# Altium schematic sheet DiPAD плата управления-2.SchDoc
size 594 x 420 mm; SheetNumber: 2; PageSetup: Record=PageOptions|CenterHorizontal=False|CenterVertical=False|PrintScale=1.00|XCorrection=0.00|YCorrection=0.00|PrintKind=2|BorderSize=5000000|LeftOffset=0|BottomOffset=0|Orientation=2|PaperLength=1000|PaperWidth=1000|Scale=100|PaperSource=7|PrintQuality=600|MediaType=1|DitherType=10|PaperKind=A2|PrintScaleMode=0; DecimalNumber: ИТЦЯ.468332.393 Э3; HeadOfSector: Нач. сектора; MainDevice: Перв.примен.; Name1: Наименование; Name2: продолжение наименования; Scale: 1:1; SoglasGrafa: Соглас.; TcontrGrafa: Т.контр.; Title2: {Title2}; Title3: {Title3}; Document_type: {Type}; InvNo: {InvNo}; Document_type2: {Type2}
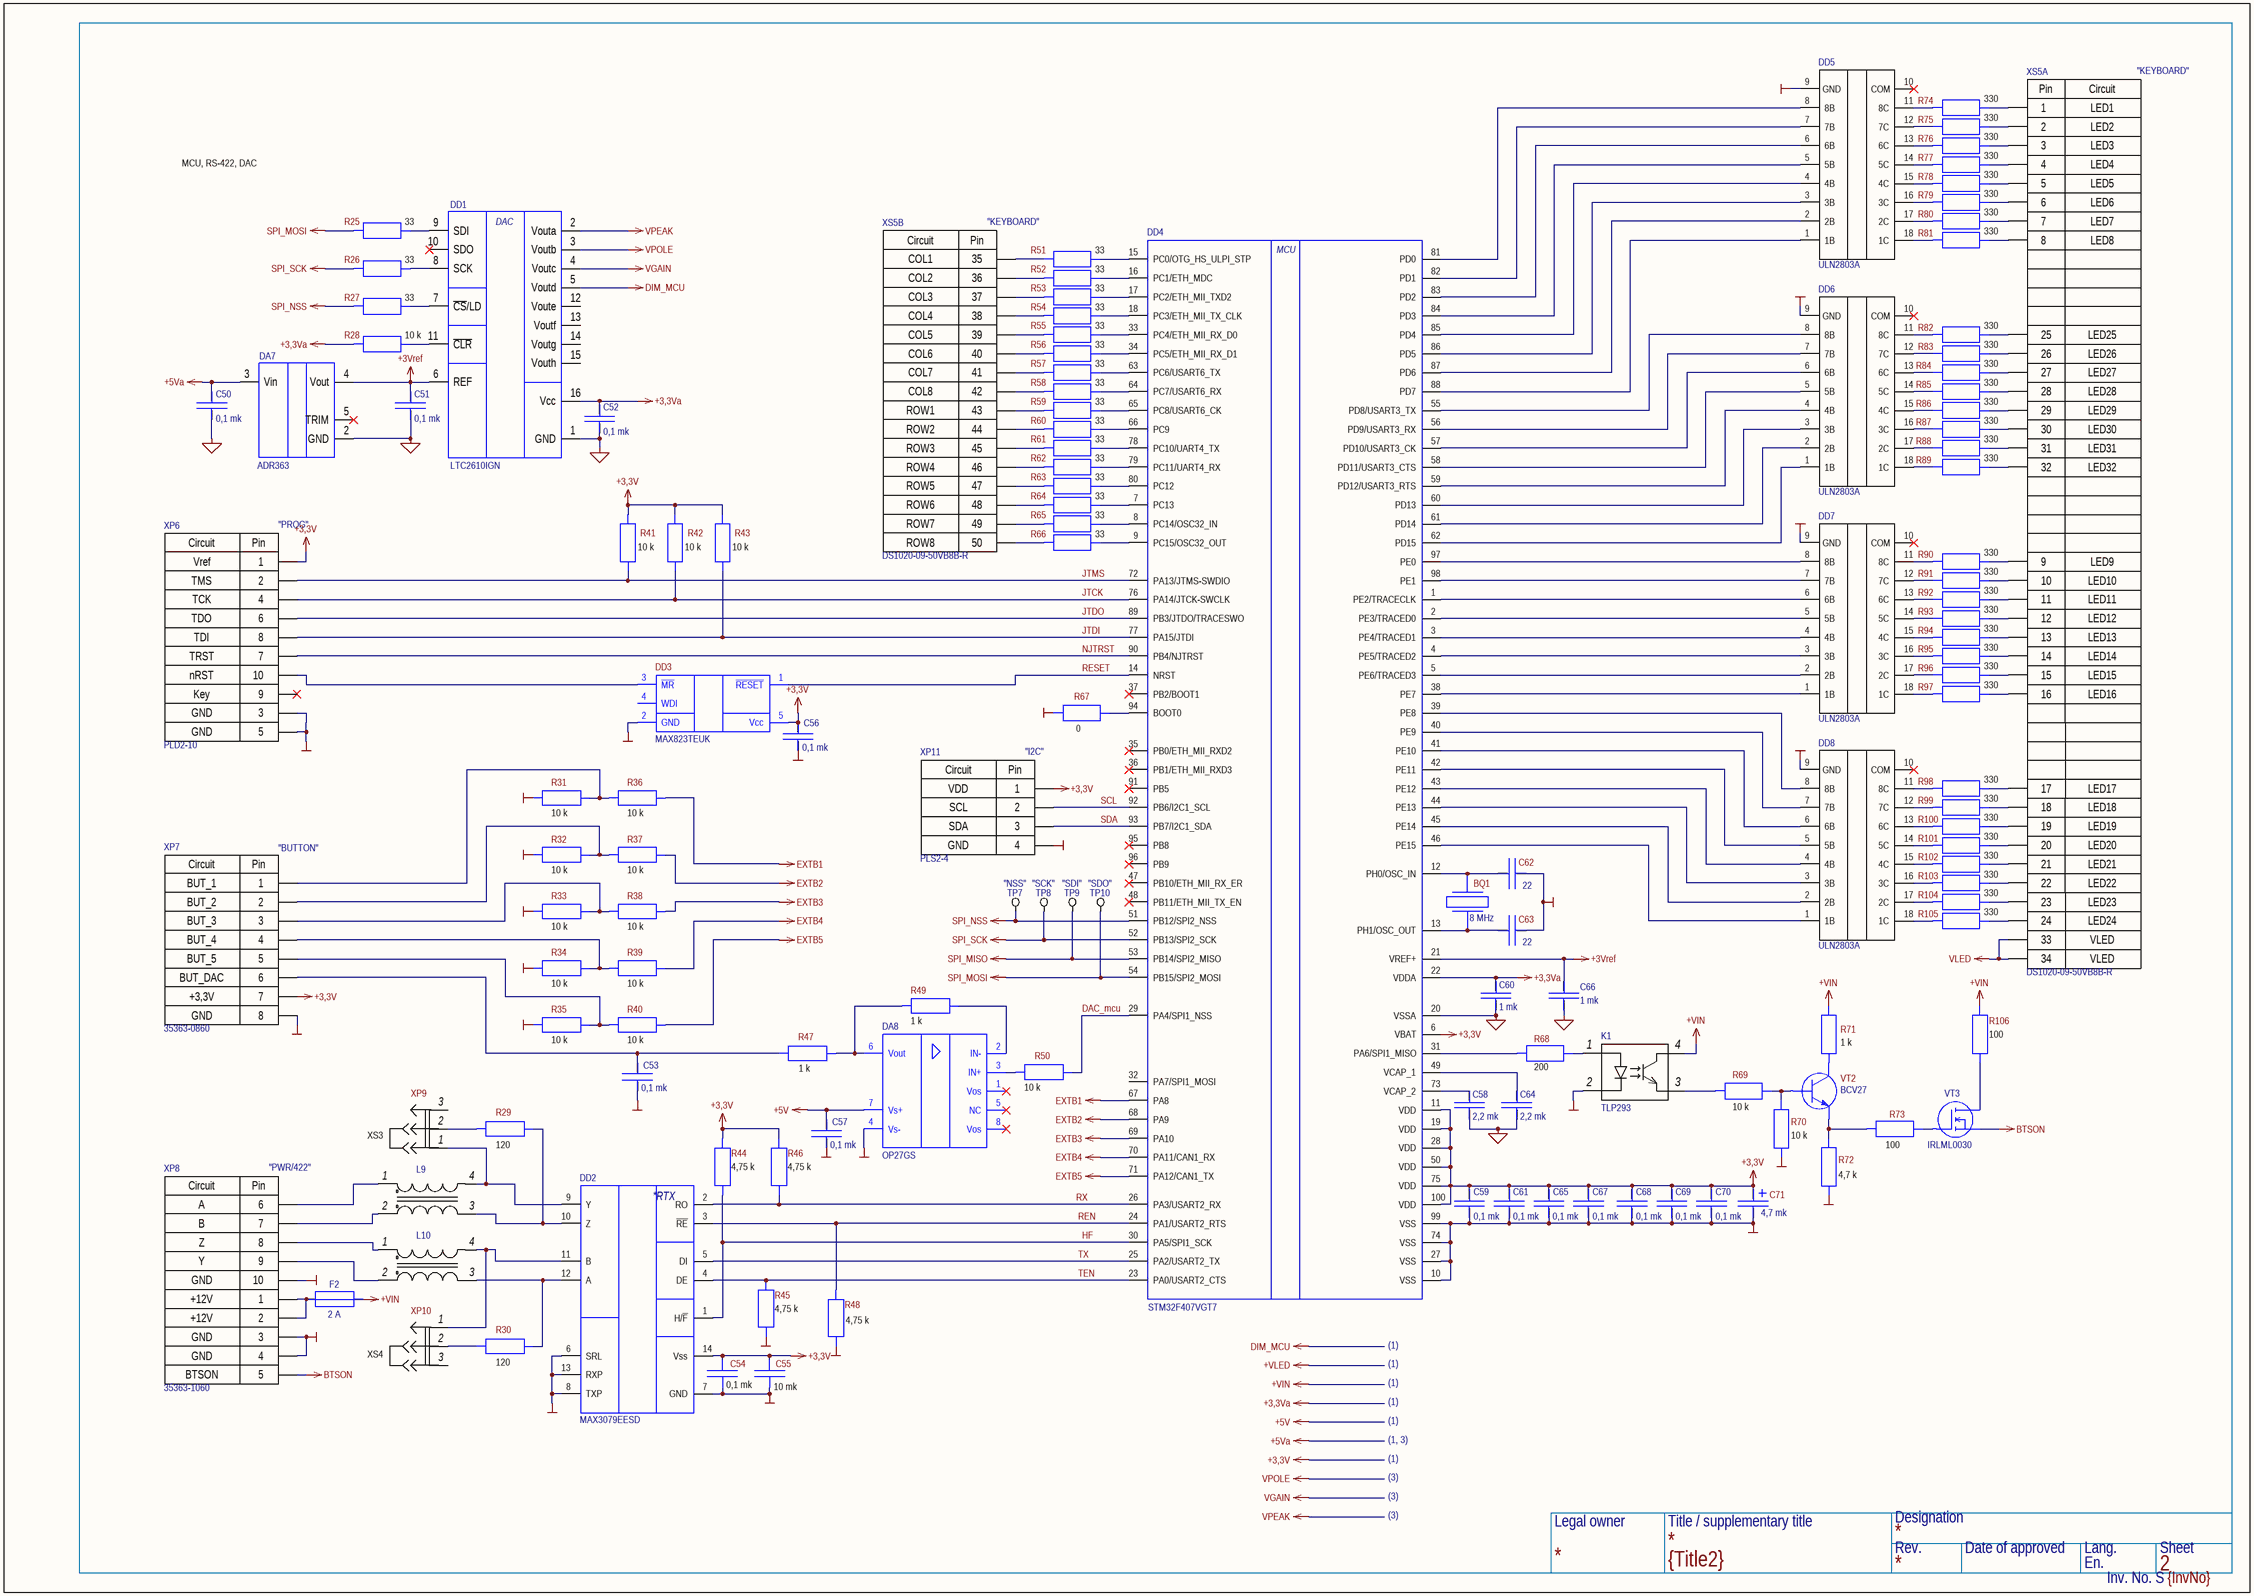
[diagram p0: DiPAD плата управления-2.SchDoc]

## Parts
BQ1  8 MHz  [CX5Z]
C50  value 0,1 mk  [C0603P(025)]  (hidden comment: C1206)
C51  value 0,1 mk  [C0603P(025)]  (hidden comment: C1206)
C52  value 0,1 mk  [C0603P(025)]  (hidden comment: C1206)
C53  value 0,1 mk  [C0603P(025)]  (hidden comment: C1206)
C54  0,1 mk  [C0603P(025)]
C55  10 mk  [C0603P(025)]
C56  value 0,1 mk  [C0603P(025)]  (hidden comment: C1206)
C57  value 0,1 mk  [C0603P(025)]  (hidden comment: C1206)
C58  value 2,2 mk  [C0603P(025)]  (hidden comment: C1206)
C59  value 0,1 mk  [C0603P(025)]  (hidden comment: C1206)
C60  value 1 mk  [C0603P(025)]  (hidden comment: C1206)
C61  value 0,1 mk  [C0603P(025)]  (hidden comment: C1206)
C62  value 22  [C0603P(025)]  (hidden comment: C0603)
C63  value 22  [C0603P(025)]  (hidden comment: C0603)
C64  value 2,2 mk  [C0603P(025)]  (hidden comment: C1206)
C65  value 0,1 mk  [C0603P(025)]  (hidden comment: C1206)
C66  value 1 mk  [C0603P(025)]  (hidden comment: C1206)
C67  value 0,1 mk  [C0603P(025)]  (hidden comment: C1206)
C68  value 0,1 mk  [C0603P(025)]  (hidden comment: C1206)
C69  value 0,1 mk  [C0603P(025)]  (hidden comment: C1206)
C70  value 0,1 mk  [C0603P(025)]  (hidden comment: C1206)
C71  value 4,7 mk  [TAJ-AP]  (hidden comment: TAJ_SMD_D)
DA7  ADR363  [ADR363]
DA8  OP27GS  [so-8P]
DD1  LTC2610IGN  [LTC2610IGN (SSOP-16)]
DD2  MAX3079EESD  [MAX3079 (SO-14)]
DD3  value MAX823TEUK  [MAX823-5]  (hidden comment: MAX823TEUKT)
DD4  STM32F407VGT7  [LQFP100]
DD5  ULN2803A  [ULN2803A (SOIC-18W)]
DD6  ULN2803A  [ULN2803A (SOIC-18W)]
DD7  ULN2803A  [ULN2803A (SOIC-18W)]
DD8  ULN2803A  [ULN2803A (SOIC-18W)]
F2  2 A  [fuse_0466 (1206)]
K1  TLP293  [TLP293(BL-TPL,E SO-4 TOSHIBA]
L9  744242471  [744242471 (WE-SLM)]  (value not drawn)
L10  744242471  [744242471 (WE-SLM)]  (value not drawn)
R25  33  [R0603P(025)]
R26  33  [R0603P(025)]
R27  33  [R0603P(025)]
R28  10 k  [R0603P(025)]
R29  120  [R1206PN]
R30  120  [R1206PN]
R31  10 k  [R0603P(025)]
R32  10 k  [R0603P(025)]
R33  10 k  [R0603P(025)]
R34  10 k  [R0603P(025)]
R35  10 k  [R0603P(025)]
R36  10 k  [R0603P(025)]
R37  10 k  [R0603P(025)]
R38  10 k  [R0603P(025)]
R39  10 k  [R0603P(025)]
R40  10 k  [R0603P(025)]
R41  10 k  [R0603P(025)]
R42  10 k  [R0603P(025)]
R43  10 k  [R0603P(025)]
R44  4,75 k  [R0603P(025)]
R45  4,75 k  [R0603P(025)]
R46  4,75 k  [R0603P(025)]
R47  1 k  [R0603P(025)]
R48  4,75 k  [R0603P(025)]
R49  1 k  [R0603P(025)]
R50  10 k  [R0603P(025)]
R51  33  [R0402P(025)]
R52  33  [R0402P(025)]
R53  33  [R0402P(025)]
R54  33  [R0402P(025)]
R55  33  [R0402P(025)]
R56  33  [R0402P(025)]
R57  33  [R0402P(025)]
R58  33  [R0402P(025)]
R59  33  [R0402P(025)]
R60  33  [R0402P(025)]
R61  33  [R0402P(025)]
R62  33  [R0402P(025)]
R63  33  [R0402P(025)]
R64  33  [R0402P(025)]
R65  33  [R0402P(025)]
R66  33  [R0402P(025)]
R67  0  [R0603P(025)]
R68  200  [R0603P(025)]
R69  10 k  [R0603P(025)]
R70  10 k  [R0603P(025)]
R71  1 k  [R0603P(025)]
R72  4,7 k  [R0603P(025)]
R73  100  [R0603P(025)]
R74  330  [R0402P(025)]
R75  330  [R0402P(025)]
R76  330  [R0402P(025)]
R77  330  [R0402P(025)]
R78  330  [R0402P(025)]
R79  330  [R0402P(025)]
R80  330  [R0402P(025)]
R81  330  [R0402P(025)]
R82  330  [R0402P(025)]
R83  330  [R0402P(025)]
R84  330  [R0402P(025)]
R85  330  [R0402P(025)]
R86  330  [R0402P(025)]
R87  330  [R0402P(025)]
R88  330  [R0402P(025)]
R89  330  [R0402P(025)]
R90  330  [R0402P(025)]
R91  330  [R0402P(025)]
R92  330  [R0402P(025)]
R93  330  [R0402P(025)]
R94  330  [R0402P(025)]
R95  330  [R0402P(025)]
R96  330  [R0402P(025)]
R97  330  [R0402P(025)]
R98  330  [R0402P(025)]
R99  330  [R0402P(025)]
R100  330  [R0402P(025)]
R101  330  [R0402P(025)]
R102  330  [R0402P(025)]
R103  330  [R0402P(025)]
R104  330  [R0402P(025)]
R105  330  [R0402P(025)]
R106  100  [R1206PN]
TP7  "NSS"  [MO 08x14]
TP8  "SCK"  [MO 08x14]
TP9  "SDI"  [MO 08x14]
TP10  "SDO"  [MO 08x14]
VT2  BCV27  [BCV27 (SOT-23 3)]
VT3  IRLML0030  [IRLML (SOT-23)]
XP6  PLD2-10  [HR M22-20210]
XP7  35363-0860  [MOLEX-35363-0860 с ответкой]
XP8  35363-1060  [MOLEX-35363-1060]
XP9  XS3  [HR M22-2010305]
XP10  XS4  [HR M22-2010305]
XP11  PLS2-4  [СНП377-4ВП21-1]
XS5  DS1020-09-50VB8B-R  [DS1020-09 (MOLEX-5051105091)]  (parts A,B of 2)

## Nets
+3,3V: C54.2 C55.2 C56.2(i/o1) C59.2(i/o1) C61.2(i/o1) C65.2(i/o1) C67.2(i/o1) C68.2(i/o1) C69.2(i/o1) C70.2(i/o1) C71.1(+) DD2.14(Vss) DD3.5(Vcc) DD4.6(VBAT) DD4.11(VDD) DD4.19(VDD) DD4.28(VDD) DD4.50(VDD) DD4.75(VDD) DD4.100(VDD) R41.2(I/O1) R42.2(I/O1) R43.2(I/O1) R44.1(I/O0) R46.1(I/O0) XP6.1 XP7.7 XP11.1
+3,3Va: C52.2(i/o1) C60.2(i/o1) DD1.16(Vcc) DD4.22(VDDA) R28.1(I/O0)
+3Vref: C51.2(i/o1) C66.2(i/o1) DA7.4(Vout) DD1.6(REF) DD4.21(VREF+)
+5V: C57.2(i/o1) DA8.7(Vs+)
+5Va: C50.2(i/o1) DA7.3(Vin)
+VIN: F2.2(I/O1) K1.4 R71.2(I/O1) R106.2(I/O1)
AGND: C50.1(i/o) C51.1(i/o) C52.1(i/o) C58.1(i/o) C60.1(i/o) C64.1(i/o) C66.1(i/o) DA7.2(GND) DD1.1(GND) DD4.20(VSSA)
BTSON: VT3.S(Source) XP8.5
DIM_MCU: DD1.5(Voutd)
EXTB1: DD4.67(PA8) R36.2(I/O1)
EXTB2: DD4.68(PA9) R37.2(I/O1)
EXTB3: DD4.69(PA10) R38.2(I/O1)
EXTB4: DD4.70(PA11/CAN1_RX) R39.2(I/O1)
EXTB5: DD4.71(PA12/CAN1_TX) R40.2(I/O1)
GND: C53.1(i/o) C54.1 C55.1 C56.1(i/o) C57.1(i/o) C59.1(i/o) C61.1(i/o) C62.2(i/o1) C63.2(i/o1) C65.1(i/o) C67.1(i/o) C68.1(i/o) C69.1(i/o) C70.1(i/o) C71.2(_) DA8.4(Vs-) DD2.6(SRL) DD2.7(GND) DD2.8(TXP) DD2.13(RXP) DD3.2(GND) DD4.10(VSS) DD4.27(VSS) DD4.74(VSS) DD4.99(VSS) DD5.9(GND) DD6.9(GND) DD7.9(GND) DD8.9(GND) K1.2 R31.1(I/O0) R32.1(I/O0) R33.1(I/O0) R34.1(I/O0) R35.1(I/O0) R45.2(I/O1) R48.2(I/O1) R67.1(I/O0) R70.1(I/O0) R72.1(I/O0) XP6.3 XP6.5 XP7.8 XP8.3 XP8.4 XP8.10 XP11.4
SPI_MISO: DD4.53(PB14/SPI2_MISO) TP9.1(I/O)
SPI_MOSI: DD4.54(PB15/SPI2_MOSI) R25.1(I/O0) TP10.1(I/O)
SPI_NSS: DD4.51(PB12/SPI2_NSS) R27.1(I/O0) TP7.1(I/O)
SPI_SCK: DD4.52(PB13/SPI2_SCK) R26.1(I/O0) TP8.1(I/O)
VGAIN: DD1.4(Voutc)
VLED: XS5.33 XS5.34
VPEAK: DD1.2(Vouta)
VPOLE: DD1.3(Voutb)
DAC_mcu: DD4.29(PA4/SPI1_NSS) R50.1(I/O0)
HF: DD2.1(H/~{F}) DD4.30(PA5/SPI1_SCK) R44.2(I/O1)
JTCK: DD4.76(PA14/JTCK-SWCLK) R42.1(I/O0) XP6.4
JTDI: DD4.77(PA15/JTDI) R43.1(I/O0) XP6.8
JTDO: DD4.89(PB3/JTDO/TRACESWO) XP6.6
JTMS: DD4.72(PA13/JTMS-SWDIO) R41.1(I/O0) XP6.2
NJTRST: DD4.90(PB4/NJTRST) XP6.7
REN: DD2.3(~{RE}) DD4.24(PA1/USART2_RTS) R48.1(I/O0)
RESET: DD3.1(~{RESET}) DD4.14(NRST)
RX: DD2.2(RO) DD4.26(PA3/USART2_RX) R46.2(I/O1)
SCL: DD4.92(PB6/I2C1_SCL) XP11.2
SDA: DD4.93(PB7/I2C1_SDA) XP11.3
TEN: DD2.4(DE) DD4.23(PA0/USART2_CTS) R45.1(I/O0)
TX: DD2.5(DI) DD4.25(PA2/USART2_TX)
NetBQ1_1: BQ1.1 C63.1(i/o) DD4.13(PH1/OSC_OUT)
NetBQ1_2: BQ1.2 C62.1(i/o) DD4.12(PH0/OSC_IN)
NetC53_2: C53.2(i/o1) R47.2(I/O1) XP7.6
NetC58_2: C58.2(i/o1) DD4.73(VCAP_2)
NetC64_2: C64.2(i/o1) DD4.49(VCAP_1)
NetDA8_2: DA8.2(IN-) R49.1(I/O0)
NetDA8_3: DA8.3(IN+) R50.2(I/O1)
NetDA8_6: DA8.6(Vout) R47.1(I/O0) R49.2(I/O1)
NetDD1_7: DD1.7(~{CS}/LD) R27.2(I/O1)
NetDD1_8: DD1.8(SCK) R26.2(I/O1)
NetDD1_9: DD1.9(SDI) R25.2(I/O1)
NetDD1_11: DD1.11(~{CLR}) R28.2(I/O1)
NetDD2_9: DD2.9(Y) L9.4 XP9.1
NetDD2_10: DD2.10(Z) L9.3 R29.1(I/O0)
NetDD2_11: DD2.11(B) L10.4 XP10.1
NetDD2_12: DD2.12(A) L10.3 R30.1(I/O0)
NetDD3_3: DD3.3(~{MR}) XP6.10
NetDD4_1: DD4.1(PE2/TRACECLK) DD7.6(6B)
NetDD4_2: DD4.2(PE3/TRACED0) DD7.5(5B)
NetDD4_3: DD4.3(PE4/TRACED1) DD7.4(4B)
NetDD4_4: DD4.4(PE5/TRACED2) DD7.3(3B)
NetDD4_5: DD4.5(PE6/TRACED3) DD7.2(2B)
NetDD4_7: DD4.7(PC13) R64.2(I/O1)
NetDD4_8: DD4.8(PC14/OSC32_IN) R65.2(I/O1)
NetDD4_9: DD4.9(PC15/OSC32_OUT) R66.2(I/O1)
NetDD4_15: DD4.15(PC0/OTG_HS_ULPI_STP) R51.2(I/O1)
NetDD4_16: DD4.16(PC1/ETH_MDC) R52.2(I/O1)
NetDD4_17: DD4.17(PC2/ETH_MII_TXD2) R53.2(I/O1)
NetDD4_18: DD4.18(PC3/ETH_MII_TX_CLK) R54.2(I/O1)
NetDD4_31: DD4.31(PA6/SPI1_MISO) R68.2(I/O1)
NetDD4_33: DD4.33(PC4/ETH_MII_RX_D0) R55.2(I/O1)
NetDD4_34: DD4.34(PC5/ETH_MII_RX_D1) R56.2(I/O1)
NetDD4_38: DD4.38(PE7) DD7.1(1B)
NetDD4_39: DD4.39(PE8) DD8.8(8B)
NetDD4_40: DD4.40(PE9) DD8.7(7B)
NetDD4_41: DD4.41(PE10) DD8.6(6B)
NetDD4_42: DD4.42(PE11) DD8.5(5B)
NetDD4_43: DD4.43(PE12) DD8.4(4B)
NetDD4_44: DD4.44(PE13) DD8.3(3B)
NetDD4_45: DD4.45(PE14) DD8.2(2B)
NetDD4_46: DD4.46(PE15) DD8.1(1B)
NetDD4_55: DD4.55(PD8/USART3_TX) DD6.8(8B)
NetDD4_56: DD4.56(PD9/USART3_RX) DD6.7(7B)
NetDD4_57: DD4.57(PD10/USART3_CK) DD6.6(6B)
NetDD4_58: DD4.58(PD11/USART3_CTS) DD6.5(5B)
NetDD4_59: DD4.59(PD12/USART3_RTS) DD6.4(4B)
NetDD4_60: DD4.60(PD13) DD6.3(3B)
NetDD4_61: DD4.61(PD14) DD6.2(2B)
NetDD4_62: DD4.62(PD15) DD6.1(1B)
NetDD4_63: DD4.63(PC6/USART6_TX) R57.2(I/O1)
NetDD4_64: DD4.64(PC7/USART6_RX) R58.2(I/O1)
NetDD4_65: DD4.65(PC8/USART6_CK) R59.2(I/O1)
NetDD4_66: DD4.66(PC9) R60.2(I/O1)
NetDD4_78: DD4.78(PC10/UART4_TX) R61.2(I/O1)
NetDD4_79: DD4.79(PC11/UART4_RX) R62.2(I/O1)
NetDD4_80: DD4.80(PC12) R63.2(I/O1)
NetDD4_81: DD4.81(PD0) DD5.8(8B)
NetDD4_82: DD4.82(PD1) DD5.7(7B)
NetDD4_83: DD4.83(PD2) DD5.6(6B)
NetDD4_84: DD4.84(PD3) DD5.5(5B)
NetDD4_85: DD4.85(PD4) DD5.4(4B)
NetDD4_86: DD4.86(PD5) DD5.3(3B)
NetDD4_87: DD4.87(PD6) DD5.2(2B)
NetDD4_88: DD4.88(PD7) DD5.1(1B)
NetDD4_94: DD4.94(BOOT0) R67.2(I/O1)
NetDD4_97: DD4.97(PE0) DD7.8(8B)
NetDD4_98: DD4.98(PE1) DD7.7(7B)
NetDD5_11: DD5.11(8C) R74.1(I/O0)
NetDD5_12: DD5.12(7C) R75.1(I/O0)
NetDD5_13: DD5.13(6C) R76.1(I/O0)
NetDD5_14: DD5.14(5C) R77.1(I/O0)
NetDD5_15: DD5.15(4C) R78.1(I/O0)
NetDD5_16: DD5.16(3C) R79.1(I/O0)
NetDD5_17: DD5.17(2C) R80.1(I/O0)
NetDD5_18: DD5.18(1C) R81.1(I/O0)
NetDD6_11: DD6.11(8C) R82.1(I/O0)
NetDD6_12: DD6.12(7C) R83.1(I/O0)
NetDD6_13: DD6.13(6C) R84.1(I/O0)
NetDD6_14: DD6.14(5C) R85.1(I/O0)
NetDD6_15: DD6.15(4C) R86.1(I/O0)
NetDD6_16: DD6.16(3C) R87.1(I/O0)
NetDD6_17: DD6.17(2C) R88.1(I/O0)
NetDD6_18: DD6.18(1C) R89.1(I/O0)
NetDD7_11: DD7.11(8C) R90.1(I/O0)
NetDD7_12: DD7.12(7C) R91.1(I/O0)
NetDD7_13: DD7.13(6C) R92.1(I/O0)
NetDD7_14: DD7.14(5C) R93.1(I/O0)
NetDD7_15: DD7.15(4C) R94.1(I/O0)
NetDD7_16: DD7.16(3C) R95.1(I/O0)
NetDD7_17: DD7.17(2C) R96.1(I/O0)
NetDD7_18: DD7.18(1C) R97.1(I/O0)
NetDD8_11: DD8.11(8C) R98.1(I/O0)
NetDD8_12: DD8.12(7C) R99.1(I/O0)
NetDD8_13: DD8.13(6C) R100.1(I/O0)
NetDD8_14: DD8.14(5C) R101.1(I/O0)
NetDD8_15: DD8.15(4C) R102.1(I/O0)
NetDD8_16: DD8.16(3C) R103.1(I/O0)
NetDD8_17: DD8.17(2C) R104.1(I/O0)
NetDD8_18: DD8.18(1C) R105.1(I/O0)
NetF2_1: F2.1(I/O0) XP8.1 XP8.2
NetK1_1: K1.1 R68.1(I/O0)
NetK1_3: K1.3 R69.1(I/O0)
NetL9_1: L9.1 XP8.6
NetL9_2: L9.2 XP8.7
NetL10_1: L10.1 XP8.8
NetL10_2: L10.2 XP8.9
NetR29_2: R29.2(I/O1) XP9.2
NetR30_2: R30.2(I/O1) XP10.2
NetR31_2: R31.2(I/O1) R36.1(I/O0) XP7.1
NetR32_2: R32.2(I/O1) R37.1(I/O0) XP7.2
NetR33_2: R33.2(I/O1) R38.1(I/O0) XP7.3
NetR34_2: R34.2(I/O1) R39.1(I/O0) XP7.4
NetR35_2: R35.2(I/O1) R40.1(I/O0) XP7.5
NetR51_1: R51.1(I/O0) XS5.35
NetR52_1: R52.1(I/O0) XS5.36
NetR53_1: R53.1(I/O0) XS5.37
NetR54_1: R54.1(I/O0) XS5.38
NetR55_1: R55.1(I/O0) XS5.39
NetR56_1: R56.1(I/O0) XS5.40
NetR57_1: R57.1(I/O0) XS5.41
NetR58_1: R58.1(I/O0) XS5.42
NetR59_1: R59.1(I/O0) XS5.43
NetR60_1: R60.1(I/O0) XS5.44
NetR61_1: R61.1(I/O0) XS5.45
NetR62_1: R62.1(I/O0) XS5.46
NetR63_1: R63.1(I/O0) XS5.47
NetR64_1: R64.1(I/O0) XS5.48
NetR65_1: R65.1(I/O0) XS5.49
NetR66_1: R66.1(I/O0) XS5.50
NetR69_2: R69.2(I/O1) R70.2(I/O1) VT2.B(Base)
NetR71_1: R71.1(I/O0) VT2.C(Collector)
NetR72_2: R72.2(I/O1) R73.2(I/O1) VT2.E(Emitter)
NetR73_1: R73.1(I/O0) VT3.G(Gate)
NetR74_2: R74.2(I/O1) XS5.1
NetR75_2: R75.2(I/O1) XS5.2
NetR76_2: R76.2(I/O1) XS5.3
NetR77_2: R77.2(I/O1) XS5.4
NetR78_2: R78.2(I/O1) XS5.5
NetR79_2: R79.2(I/O1) XS5.6
NetR80_2: R80.2(I/O1) XS5.7
NetR81_2: R81.2(I/O1) XS5.8
NetR82_2: R82.2(I/O1) XS5.25
NetR83_2: R83.2(I/O1) XS5.26
NetR84_2: R84.2(I/O1) XS5.27
NetR85_2: R85.2(I/O1) XS5.28
NetR86_2: R86.2(I/O1) XS5.29
NetR87_2: R87.2(I/O1) XS5.30
NetR88_2: R88.2(I/O1) XS5.31
NetR89_2: R89.2(I/O1) XS5.32
NetR90_2: R90.2(I/O1) XS5.9
NetR91_2: R91.2(I/O1) XS5.10
NetR92_2: R92.2(I/O1) XS5.11
NetR93_2: R93.2(I/O1) XS5.12
NetR94_2: R94.2(I/O1) XS5.13
NetR95_2: R95.2(I/O1) XS5.14
NetR96_2: R96.2(I/O1) XS5.15
NetR97_2: R97.2(I/O1) XS5.16
NetR98_2: R98.2(I/O1) XS5.17
NetR99_2: R99.2(I/O1) XS5.18
NetR100_2: R100.2(I/O1) XS5.19
NetR101_2: R101.2(I/O1) XS5.20
NetR102_2: R102.2(I/O1) XS5.21
NetR103_2: R103.2(I/O1) XS5.22
NetR104_2: R104.2(I/O1) XS5.23
NetR105_2: R105.2(I/O1) XS5.24
NetR106_1: R106.1(I/O0) VT3.D(Drain)

Not connected (* = marked no-connect by the designer): DA7 1(NC) 5(TRIM)*; DA8 1(Vos)* 5(NC)* 8(Vos)*; DD1 10(SDO)* 12(Voute) 13(Voutf) 14(Voutg) 15(Vouth); DD3 4(WDI); DD4 32(PA7/SPI1_MOSI) 35(PB0/ETH_MII_RXD2)* 36(PB1/ETH_MII_RXD3)* 37(PB2/BOOT1)* 47(PB10/ETH_MII_RX_ER)* 48(PB11/ETH_MII_TX_EN)* 91(PB5)* 95(PB8)* 96(PB9)*; DD5 10(COM)*; DD6 10(COM)*; DD7 10(COM)*; DD8 10(COM)*; XP6 9*; XP9 3; XP10 3

## Notes on the sheet
- "KEYBOARD"
- MCU, RS-422, DAC
- (near XS5) "KEYBOARD"
- (near XP6) "PROG"
- (near XP11) "I2C"
- (near XP7) "BUTTON"
- (near XP8) "PWR/422"
- (1)
- (1, 3)
- (3)
- Legal owner
- Title / supplementary title
- Rev.
- Designation
- Date of approved
- Lang.
- Sheet
- En.
- Inv. No. S
- (in symbol LTC2610xGN) DAC
- (in symbol MAX3079EESD) *RTX
- (in symbol STM32F407VGT7) MCU

## Library data of the parts
BQ1 = ZQ
C54 C55 = C: Capacitor; Value: 1u
C71 = TAJ_SMD_D: pin to pad: 1>+ 2>_
DA7 = ADR363: Low Power, Low Noise Voltage References  with Sink/Source Capability; Value: {Value}
DA8 = OP27GS/177gs
DD1 = LTC2610xGN: 8-CH, 14 Bit DACs, SPI, SSOP-16
DD2 = MAX3079EESD: RS-485/RS-422 Transceivers, +3.3V, ±15kV ESD-Protected, Fail-Safe,  Hot-Swap
DD3 = MAX823TEUKT: супервайзер пит.3V, SOT23
DD4 = STM32F407VGT7: 100pin, Cortex-M4 32bit, 1Mb Flash, USB, ETH, 3 ADCs, LQFN-100 pin
DD5-DD8 = ULN2803A: Darlington Transistor Array 8 ch
F2 = MCHTC-100M: Value: *
K1 = TLP293: PhotoMOS RELAY
L9 L10 = 744242471: WE-SLM SMD Common Mode Line Filter
R25-R106 = R0603: R; Value: 1k
TP7-TP10 = TP: TestPoint; Value: *
VT2 = КТ368А9: BJT(NPN)
VT3 = Полевой транзистор N-типа: MOSFET N-channel
XP6 = 10-pin: 10-pin connector; c11: cont11; c1: Vref; c2: TMS; c3: TCK; c4: TDO; c5: TDI; c6: TRST; c7: nRST; c8: Key; c9: GND; c12: cont12; c13: cont13; c14: cont14; c15: cont15; c16: cont16; c17: cont17; c18: cont18; c19: cont19; c20: cont20; c21: cont21; c22: cont22; c23: cont23; c24: cont24; c25: cont25; c26: cont26; c27: cont27; c28: cont28; c29: cont29; c30: cont30; c31: cont31; c32: cont32; c33: cont33; c34: cont34; c35: cont35; c36: cont36; c37: cont37; c38: cont38; c39: cont39; c40: cont40; c41: cont41; c42: cont42; c43: cont43; c44: cont44; c45: cont45; c46: cont46; c47: cont47; c48: cont48; c49: cont49; c50: cont50; c10: GND; pin: Pin; circuit: Circuit
XP7 = 8-pin: 8-pin connector; c11: cont11; c1: BUT_1; c2: BUT_2; c3: BUT_3; c4: BUT_4; c5: BUT_5; c6: BUT_DAC; c7: +3,3V; c8: GND; c9: cont9; c10: cont10; c12: cont12; c13: cont13; c14: cont14; c15: cont15; c16: cont16; c17: cont17; c18: cont18; c19: cont19; c20: cont20; c21: cont21; c22: cont22; c23: cont23; c24: cont24; c25: cont25; c26: cont26; c27: cont27; c28: cont28; c29: cont29; c30: cont30; c31: cont31; c32: cont32; c33: cont33; c34: cont34; c35: cont35; c36: cont36; c37: cont37; c38: cont38; c39: cont39; c40: cont40; c41: cont41; c42: cont42; c43: cont43; c44: cont44; c45: cont45; c46: cont46; c47: cont47; c48: cont48; c49: cont49; c50: cont50; pin: Pin; circuit: Circuit
XP8 = 10-pin: 10-pin connector; c11: Y; c1: A; c2: B; c3: Z; c5: GND; c6: +12V; c10: BTSON; c21: cont21; c22: cont22; c23: cont23; c24: cont24; c25: cont25; c26: cont26; c27: cont27; c28: cont28; c29: cont29; c30: cont30; c31: cont31; c32: cont32; c33: cont33; c34: cont34; c35: cont35; c36: cont36; c37: cont37; c38: cont38; c39: cont39; c40: cont40; c41: cont41; c42: cont42; c43: cont43; c44: cont44; c45: cont45; c46: cont46; c47: cont47; c48: cont48; c49: cont49; c50: cont50; c4: Y; c7: +12V; c8: GND; c9: GND; c12: Z; c13: B; c14: A; c15: GND; c16: +12V; c17: +12V; c18: GND; c19: GND; c20: BTSON; pin: Pin; circuit: Circuit
XP9 XP10 = Jumper 3PIN: Jumper 3 pins; Value: *
XP11 = 4-pin: 4-pin connector; c11: cont11; c1: VDD; c2: SCL; c3: SDA; c4: GND; c5: cont5; c6: cont6; c7: cont7; c8: cont8; c9: cont9; c10: cont10; c12: cont12; c13: cont13; c14: cont14; c15: cont15; c16: cont16; c17: cont17; c18: cont18; c19: cont19; c20: cont20; c21: cont21; c22: cont22; c23: cont23; c24: cont24; c25: cont25; c26: cont26; c27: cont27; c28: cont28; c29: cont29; c30: cont30; c31: cont31; c32: cont32; c33: cont33; c34: cont34; c35: cont35; c36: cont36; c37: cont37; c38: cont38; c39: cont39; c40: cont40; c41: cont41; c42: cont42; c43: cont43; c44: cont44; c45: cont45; c46: cont46; c47: cont47; c48: cont48; c49: cont49; c50: cont50; pin: Pin; circuit: Circuit
XS5 = 50-pin 2 parts: 50-pin connector; c11: LED27; c1: LED1; c2: LED2; c3: LED3; c4: LED4; c5: LED5; c6: LED6; c7: LED7; c8: LED8; c9: LED25; c10: LED26; c12: LED28; c13: LED29; c14: LED30; c15: LED31; c16: LED32; c17: LED9; c18: LED10; c19: LED11; c20: LED12; c21: LED13; c22: LED14; c23: LED15; c24: LED16; c25: LED17; c26: LED18; c27: LED19; c28: LED20; c29: LED21; c30: LED22; c31: LED23; c32: LED24; c33: VLED; c35: cont35; c36: cont36; c37: cont37; c38: cont38; c39: cont39; c40: cont40; c41: cont41; c42: cont42; c43: cont43; c44: cont44; c45: cont45; c46: cont46; c47: cont47; c48: cont48; c49: cont49; c50: cont50; c34: VLED; pin: Pin; circuit: Circuit